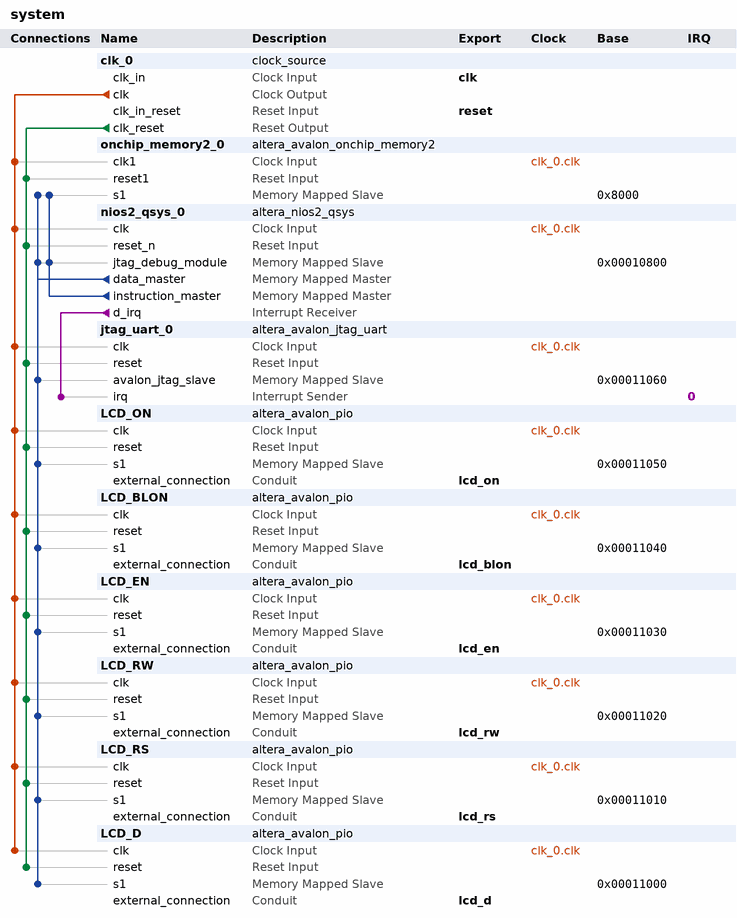
[diagram p0: system contents]
# Platform Designer (Qsys) system system, Cyclone II EP2C35F672C6
# Parameters at their usual value, and those the tool derives, are not listed.
package require -exact qsys 13.0.1.99.2
create_system system
set_project_property DEVICE_FAMILY {Cyclone II}
set_project_property DEVICE EP2C35F672C6

add_instance clk_0 clock_source 13.0
set_instance_parameter_value clk_0 clockFrequency 50000000

add_instance onchip_memory2_0 altera_avalon_onchip_memory2 13.0.1.99.2
set_instance_parameter_value onchip_memory2_0 dataWidth 32
set_instance_parameter_value onchip_memory2_0 dualPort false
set_instance_parameter_value onchip_memory2_0 initMemContent true
set_instance_parameter_value onchip_memory2_0 initializationFileName onchip_mem.hex
set_instance_parameter_value onchip_memory2_0 memorySize 32768

add_instance nios2_qsys_0 altera_nios2_qsys 13.0
set_instance_parameter_value nios2_qsys_0 resetSlave onchip_memory2_0.s1
set_instance_parameter_value nios2_qsys_0 mmu_TLBMissExcSlave None
set_instance_parameter_value nios2_qsys_0 exceptionSlave onchip_memory2_0.s1
set_instance_parameter_value nios2_qsys_0 breakSlave nios2_qsys_0.jtag_debug_module
set_instance_parameter_value nios2_qsys_0 impl Tiny
set_instance_parameter_value nios2_qsys_0 icache_size 4096

add_instance jtag_uart_0 altera_avalon_jtag_uart 13.0.1.99.2
set_instance_parameter_value jtag_uart_0 simInteractiveOptions NO_INTERACTIVE_WINDOWS

add_instance LCD_ON altera_avalon_pio 13.0.1.99.2
set_instance_parameter_value LCD_ON direction Output
set_instance_parameter_value LCD_ON width 1

add_instance LCD_BLON altera_avalon_pio 13.0.1.99.2
set_instance_parameter_value LCD_BLON direction Output
set_instance_parameter_value LCD_BLON width 1

add_instance LCD_EN altera_avalon_pio 13.0.1.99.2
set_instance_parameter_value LCD_EN direction Output
set_instance_parameter_value LCD_EN width 1

add_instance LCD_RW altera_avalon_pio 13.0.1.99.2
set_instance_parameter_value LCD_RW direction Output
set_instance_parameter_value LCD_RW width 1

add_instance LCD_RS altera_avalon_pio 13.0.1.99.2
set_instance_parameter_value LCD_RS direction Output
set_instance_parameter_value LCD_RS width 1

add_instance LCD_D altera_avalon_pio 13.0.1.99.2
set_instance_parameter_value LCD_D direction Output
set_instance_parameter_value LCD_D width 8

# connections
add_connection clk_0.clk jtag_uart_0.clk clock
add_connection clk_0.clk LCD_BLON.clk clock
add_connection clk_0.clk LCD_D.clk clock
add_connection clk_0.clk LCD_EN.clk clock
add_connection clk_0.clk LCD_ON.clk clock
add_connection clk_0.clk LCD_RS.clk clock
add_connection clk_0.clk LCD_RW.clk clock
add_connection clk_0.clk nios2_qsys_0.clk clock
add_connection clk_0.clk onchip_memory2_0.clk1 clock
add_connection clk_0.clk_reset jtag_uart_0.reset reset
add_connection clk_0.clk_reset LCD_BLON.reset reset
add_connection clk_0.clk_reset LCD_D.reset reset
add_connection clk_0.clk_reset LCD_EN.reset reset
add_connection clk_0.clk_reset LCD_ON.reset reset
add_connection clk_0.clk_reset LCD_RS.reset reset
add_connection clk_0.clk_reset LCD_RW.reset reset
add_connection clk_0.clk_reset nios2_qsys_0.reset_n reset
add_connection clk_0.clk_reset onchip_memory2_0.reset1 reset
add_connection nios2_qsys_0.data_master jtag_uart_0.avalon_jtag_slave avalon
set_connection_parameter_value nios2_qsys_0.data_master/jtag_uart_0.avalon_jtag_slave baseAddress 0x00011060
add_connection nios2_qsys_0.data_master LCD_BLON.s1 avalon
set_connection_parameter_value nios2_qsys_0.data_master/LCD_BLON.s1 baseAddress 0x00011040
add_connection nios2_qsys_0.data_master LCD_D.s1 avalon
set_connection_parameter_value nios2_qsys_0.data_master/LCD_D.s1 baseAddress 0x00011000
add_connection nios2_qsys_0.data_master LCD_EN.s1 avalon
set_connection_parameter_value nios2_qsys_0.data_master/LCD_EN.s1 baseAddress 0x00011030
add_connection nios2_qsys_0.data_master LCD_ON.s1 avalon
set_connection_parameter_value nios2_qsys_0.data_master/LCD_ON.s1 baseAddress 0x00011050
add_connection nios2_qsys_0.data_master LCD_RS.s1 avalon
set_connection_parameter_value nios2_qsys_0.data_master/LCD_RS.s1 baseAddress 0x00011010
add_connection nios2_qsys_0.data_master LCD_RW.s1 avalon
set_connection_parameter_value nios2_qsys_0.data_master/LCD_RW.s1 baseAddress 0x00011020
add_connection nios2_qsys_0.data_master nios2_qsys_0.jtag_debug_module avalon
set_connection_parameter_value nios2_qsys_0.data_master/nios2_qsys_0.jtag_debug_module baseAddress 0x00010800
add_connection nios2_qsys_0.data_master onchip_memory2_0.s1 avalon
set_connection_parameter_value nios2_qsys_0.data_master/onchip_memory2_0.s1 baseAddress 0x8000
add_connection nios2_qsys_0.instruction_master nios2_qsys_0.jtag_debug_module avalon
set_connection_parameter_value nios2_qsys_0.instruction_master/nios2_qsys_0.jtag_debug_module baseAddress 0x00010800
add_connection nios2_qsys_0.instruction_master onchip_memory2_0.s1 avalon
set_connection_parameter_value nios2_qsys_0.instruction_master/onchip_memory2_0.s1 baseAddress 0x8000
add_connection nios2_qsys_0.d_irq jtag_uart_0.irq interrupt
set_connection_parameter_value nios2_qsys_0.d_irq/jtag_uart_0.irq irqNumber 0

# exported interfaces
add_interface clk clock sink
set_interface_property clk EXPORT_OF clk_0.clk_in
add_interface lcd_on conduit end
set_interface_property lcd_on EXPORT_OF LCD_ON.external_connection
add_interface lcd_blon conduit end
set_interface_property lcd_blon EXPORT_OF LCD_BLON.external_connection
add_interface lcd_en conduit end
set_interface_property lcd_en EXPORT_OF LCD_EN.external_connection
add_interface lcd_rw conduit end
set_interface_property lcd_rw EXPORT_OF LCD_RW.external_connection
add_interface lcd_rs conduit end
set_interface_property lcd_rs EXPORT_OF LCD_RS.external_connection
add_interface lcd_d conduit end
set_interface_property lcd_d EXPORT_OF LCD_D.external_connection
add_interface reset reset sink
set_interface_property reset EXPORT_OF clk_0.clk_in_reset

set_interconnect_requirement {$system} qsys_mm.clockCrossingAdapter HANDSHAKE
set_interconnect_requirement {$system} qsys_mm.maxAdditionalLatency 1

save_system system.qsys
